# EAGLE design SOFTWEAR_microbit2 (EAGLE 9.4.2)
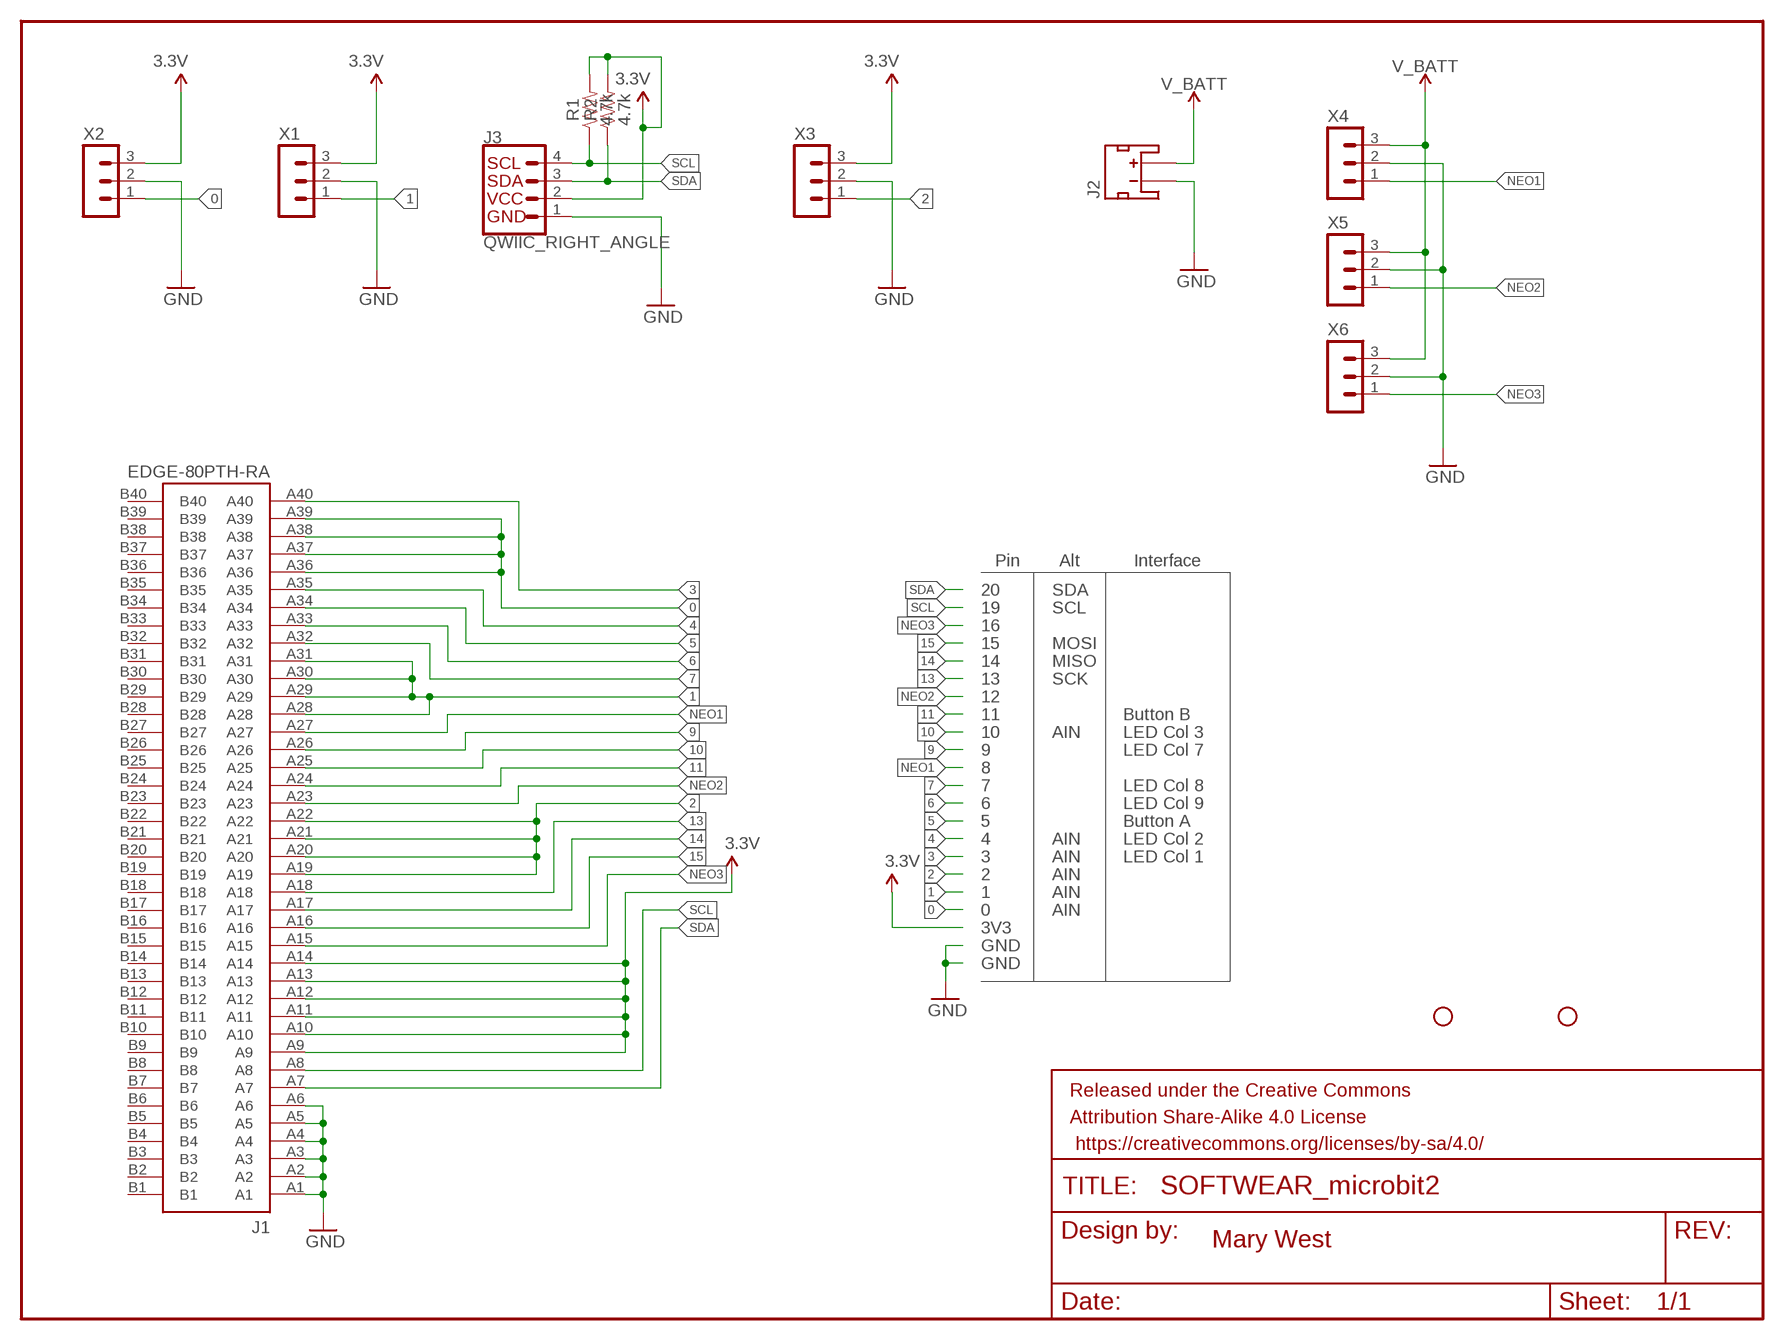
[diagram p0: schematic, sheet 1]

## Parts
FRAME2  FRAME-LETTERNO_PACKAGE  [DUMMY]
H1  STAND-OFF  [STAND-OFF]
H2  STAND-OFF  [STAND-OFF]
J1  EDGE-80PTH-RA  [VEC-127-080-R]
J2  JST_2MM_MALE  [JST-2-SMD]
J3  QWIIC_RIGHT_ANGLE  QWIIC_CONNECTORJS-1MM  [JST04_1MM_RA]
R1  4.7k  4.7KOHM-0603-1/10W-1%  [0603]
R2  4.7k  4.7KOHM-0603-1/10W-1%  [0603]
X1  SM03B-SRSS-TB  [SM03B-SRSS-TB]
X2  SM03B-SRSS-TB  [SM03B-SRSS-TB]
X3  SM03B-SRSS-TB  [SM03B-SRSS-TB]
X4  SM03B-SRSS-TB  [SM03B-SRSS-TB]
X5  SM03B-SRSS-TB  [SM03B-SRSS-TB]
X6  SM03B-SRSS-TB  [SM03B-SRSS-TB]

## Nets
0: J1.A36 J1.A37 J1.A38 J1.A39 X2.1
1: J1.A28 J1.A29 J1.A30 J1.A31 X1.1
2: J1.A19 J1.A20 J1.A21 J1.A22 X3.1
3: J1.A40
3.3V: J1.A9 J1.A10 J1.A11 J1.A12 J1.A13 J1.A14 J3.2 R1.2 R2.2 X1.3 X2.3 X3.3
4: J1.A35
5: J1.A34
6: J1.A33
7: J1.A32
9: J1.A26
10: J1.A25
11: J1.A24
13: J1.A18
14: J1.A17
15: J1.A16
GND: J1.A1 J1.A2 J1.A3 J1.A4 J1.A5 J1.A6 J2.1(-) J3.1 X1.2 X2.2 X3.2 X4.2 X5.2 X6.2
NEO1: J1.A27 X4.1
NEO2: J1.A23 X5.1
NEO3: J1.A15 X6.1
SCL: J1.A8 J3.4 R1.1
SDA: J1.A7 J3.3 R2.1
V_BATT: J2.2(+) X4.3 X5.3 X6.3
Unconnected: J1.B1 J1.B2 J1.B3 J1.B4 J1.B5 J1.B6 J1.B7 J1.B8 J1.B9 J1.B10 J1.B11 J1.B12 J1.B13 J1.B14 J1.B15 J1.B16 J1.B17 J1.B18 J1.B19 J1.B20 J1.B21 J1.B22 J1.B23 J1.B24 J1.B25 J1.B26 J1.B27 J1.B28 J1.B29 J1.B30 J1.B31 J1.B32 J1.B33 J1.B34 J1.B35 J1.B36 J1.B37 J1.B38 J1.B39 J1.B40 J2.NC1(PAD1) J2.NC2(PAD2)

## Notes on the sheet
- Pin | Alt | Interface
- 20 | SDA
- 19 | SCL
- 16
- 15 | MOSI
- 14 | MISO
- 13 | SCK
- 12
- 11 | Button B
- 10 | AIN | LED Col 3
- 9 | LED Col 7
- 8
- 7 | LED Col 8
- 6 | LED Col 9
- 5 | Button A
- 4 | AIN | LED Col 2
- 3 | AIN | LED Col 1
- 2 | AIN
- 1 | AIN
- 0 | AIN
- 3V3
- GND
- GND
- Mary West

## Library data of the parts
FRAME2 = SparkFun-Aesthetics:FRAME-LETTER: Schematic Frame - Letter Standard 8.5x11 US Letter frame; DESIGNER: Nobody; VERSION: v01
H1 H2 = SparkFun-Electromechanical:STAND-OFF: #4 Stand Off This is the mechanical footprint for a #4 phillips button head screw. Use the keepout ring to avoid running the screw head into surrounding components. SKU : PRT-00447
J1 = local_lib:EDGE-80: Card edge connector (80 pin) for accepting a PCB with finger edge pins. This connector will accept the BBC micro:bit board.; PROD_ID: CONN-13452
J2 = SparkFun-Connectors:JST_2MM_MALE: JST 2MM MALE RA CONNECTOR Two pin, compact surface mount connector. Commonly used as a battery input connection point. We really like the solid locking feeling and high current rating on these small connectors. We use these all the time as battery connectors. Mates to single-cell LiPo batteries. Here is the connector we sell at SparkFun: JST Right Angle Connector - White <https://www.sparkfun.com/products/8612> (PRT-08612) Datasheet <http://www.sparkfun.com/datasheets/Prototyping/Connectors/JST-Horizontal.pdf> It was used on these SparkFun products: SparkFun MOSFET Power Controller <https://www.sparkfun.com/products/11214> (PRT-11214) SparkFun Battery Babysitter - LiPo Battery Manager <https://www.sparkfun.com/products/13777> (PRT-13777) And many, many others that required a lipo battery connection.; PROD_ID: CONN-11443; SF_ID: PRT-08612
J3 = SparkFun-Connectors:QWIIC_CONNECTOR: SparkFun I2C Standard Qwiic Connector An SMD 1mm pitch JST connector makes it easy and quick (get it? Qwiic?) to connect I2C devices to each other. The Qwiic system <http://www.sparkfun.com/qwiic> enables fast and solderless connection between popular platforms and various sensors and actuators. We carry 200mm <https://www.sparkfun.com/products/14204>, 100mm <https://www.sparkfun.com/products/14205>, 50mm <https://www.sparkfun.com/products/14206>, and breadboard friendly <https://www.sparkfun.com/products/14207> Qwiic cables. We also offer 10 pcs strips <https://www.sparkfun.com/products/14323> the SMD connectors.; PROD_ID: CONN-13694
R1 R2 = SparkFun-Resistors:4.7KOHM: 4.7kΩ resistor A resistor is a passive two-terminal electrical component that implements electrical resistance as a circuit element. Resistors act to reduce current flow, and, at the same time, act to lower voltage levels within circuits. - Wikipedia; PROD_ID: RES-07857
X1-X6 = con-JST SH (1):SM03B-SRSS: JST SH series header 1.00mm pitch disconnectable crimp style connectors, horizontal (side entry type), 3 pins

## Board
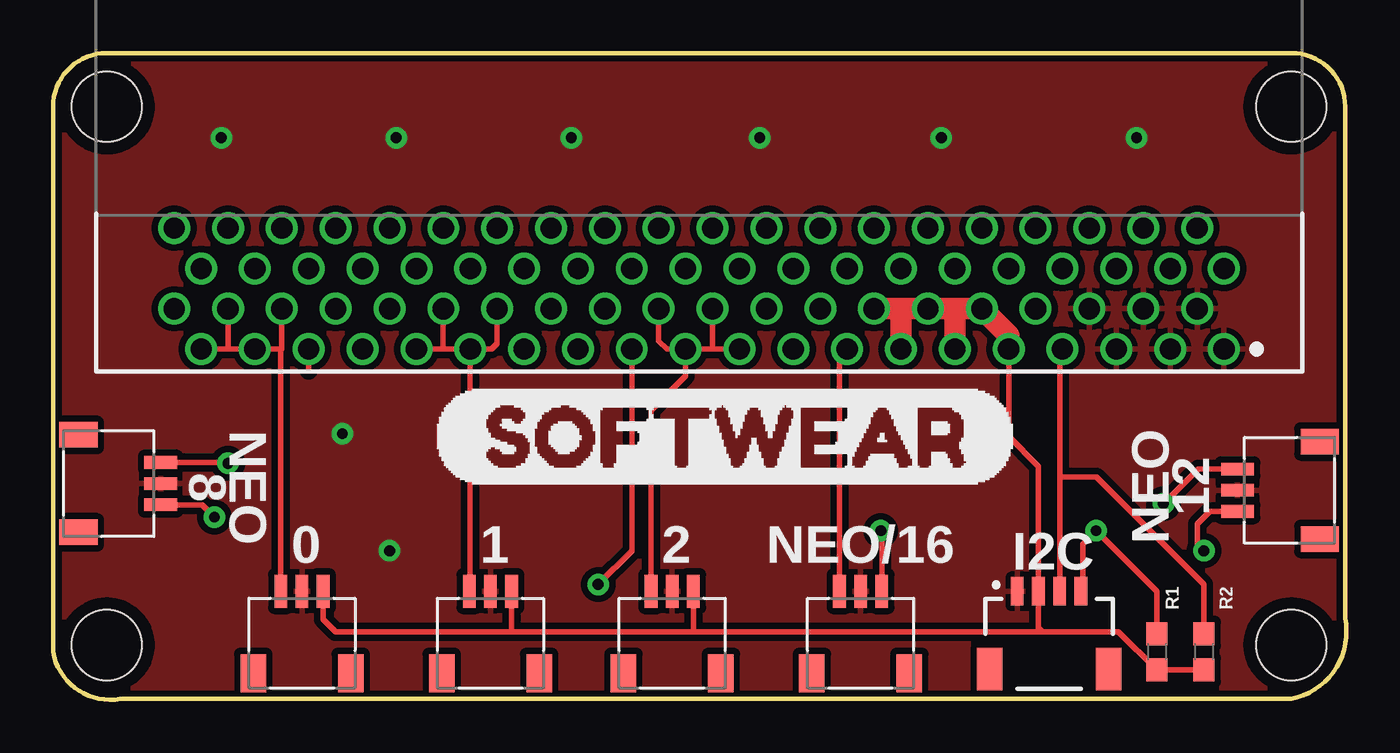
[diagram p1: board, top side]
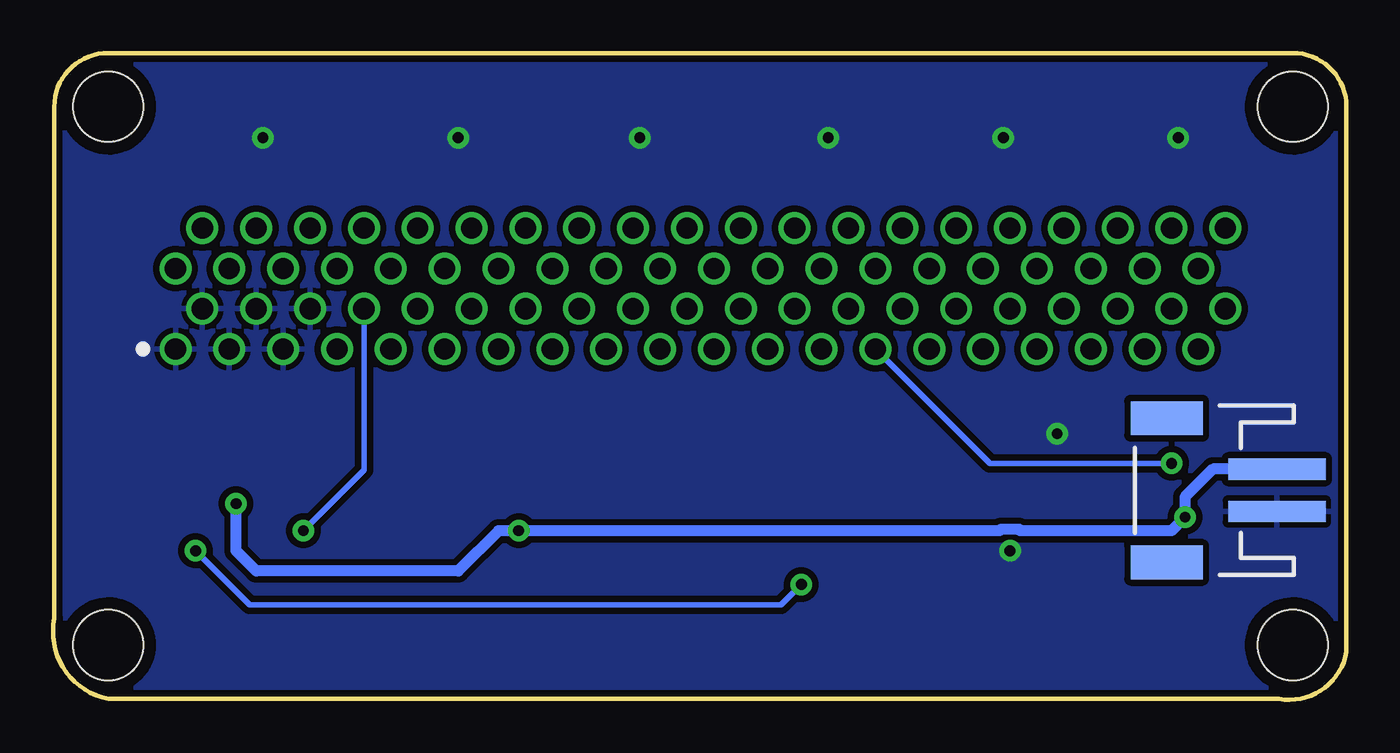
[diagram p2: board, bottom side, seen from below]

Size 61.02 x 30.52 mm. Coordinates in mm from the lower left corner, seen from the top.
Outline: 2.54,30.52 58.42,30.52 arc-90 60.96,27.98 60.96,3.85 arc-90 58.42,0.04 3.18,0.04 arc-90 0,2.26 0,27.98
Outline: 2.54,30.52 arc90 0,27.98
Outline: 2.54,30.52 arc90 0,27.98
Copper layers (1*16): Top 0.035mm / dielectric 1.5mm / Bottom 0.035mm
Design rules "SparkFun-2-layer-STANDARD": minimum track width 10mil, minimum drill 20mil, track to track 10mil, track to pad 8mil, pad to pad 8mil, via to via 10mil, smd to smd 8mil, copper to edge 8mil, drill to drill 8mil, minimum pad ring 10mil, minimum via ring 10mil, stop-mask expansion 4mil, vias tented up to drill 25mil, thermal gap 10mil

### Footprints (pad centres in the part's own frame; a part is rotated, then mirrored left to right if it is on the bottom)
STAND-OFF = hole 3.302: 0,0
VEC-127-080-R = drill 1: A1 -24.765,0; A2 -23.495,-1.9; A3 -22.225,0; A4 -20.955,-1.9; A5 -19.685,0; A6 -18.415,-1.9; A7 -17.145,0; A8 -15.875,-1.9; A9 -14.605,0; A10 -13.335,-1.9; A11 -12.065,0; A12 -10.795,-1.9; A13 -9.525,0; A14 -8.255,-1.9; A15 -6.985,0; A16 -5.715,-1.9; A17 -4.445,0; A18 -3.175,-1.9; A19 -1.905,0; A20 -0.635,-1.9; A21 0.635,0; A22 1.905,-1.9; A23 3.175,0; A24 4.445,-1.9; A25 5.715,0; A26 6.985,-1.9; A27 8.255,0; A28 9.525,-1.9; A29 10.795,0; A30 12.065,-1.9; A31 13.335,0; A32 14.605,-1.9; A33 15.875,0; A34 17.145,-1.9; A35 18.415,0; A36 19.685,-1.9; A37 20.955,0; A38 22.225,-1.9; A39 23.495,0; A40 24.765,-1.9; B1 -24.765,-3.8; B2 -23.495,-5.7; B3 -22.225,-3.8; B4 -20.955,-5.7; B5 -19.685,-3.8; B6 -18.415,-5.7; B7 -17.145,-3.8; B8 -15.875,-5.7; B9 -14.605,-3.8; B10 -13.335,-5.7; B11 -12.065,-3.8; B12 -10.795,-5.7; B13 -9.525,-3.8; B14 -8.255,-5.7; B15 -6.985,-3.8; B16 -5.715,-5.7; B17 -4.445,-3.8; B18 -3.175,-5.7; B19 -1.905,-3.8; B20 -0.635,-5.7; B21 0.635,-3.8; B22 1.905,-5.7; B23 3.175,-3.8; B24 4.445,-5.7; B25 5.715,-3.8; B26 6.985,-5.7; B27 8.255,-3.8; B28 9.525,-5.7; B29 10.795,-3.8; B30 12.065,-5.7; B31 13.335,-3.8; B32 14.605,-5.7; B33 15.875,-3.8; B34 17.145,-5.7; B35 18.415,-3.8; B36 19.685,-5.7; B37 20.955,-3.8; B38 22.225,-5.7; B39 23.495,-3.8; B40 24.765,-5.7
JST-2-SMD = smd 1 x 4.6: 1 -1,-3.7; 2 1,-3.7 | smd 1.6 x 3.4: NC1 -3.4,1.5; NC2 3.4,1.5
JST04_1MM_RA = smd 0.6 x 1.35: 1 -1.5,0; 2 -0.5,0; 3 0.5,0; 4 1.5,0 | smd 1.2 x 2: NC1 2.8,-3.675; NC2 -2.8,-3.675
0603 = smd 1.1 x 1: 1 -0.85,0; 2 0.85,0
SM03B-SRSS-TB = smd 0.6 x 1.55: 1 1,0; 2 0,0; 3 -1,0 | smd 1.2 x 1.8: M1 2.3,3.875; M2 -2.3,3.875

### Placement (x,y rotation side)
FRAME2  0,-1.23 0 top
H1  2.54,27.98 0 top
H2  58.42,27.98 0 top
H3  STAND-OFF  [STAND-OFF]  58.42,2.58 0 top
H4  STAND-OFF  [STAND-OFF]  2.54,2.58 0 top
J1  30.48,16.55 180 top
J2  6.98,9.88 90 bottom
J3  46.99,5.12 0 top
R1  52.07,2.26 270 top
R2  54.29,2.26 270 top
U$1  [SOFTWEAR0]  17.78,12.42 0 top
X1  20.64,5.12 180 top
X2  11.75,5.12 180 top
X3  29.21,5.12 180 top
X4  5.08,10.2 90 top
X5  55.88,9.88 270 top
X6  38.1,5.12 180 top

### Tracks (layer width: path | path; a pad name or v marks a point on that pad's centre or on a via)
0
  Top 0.254: J1.A39 8.25,16.55 | 8.25,16.55 J1.A37 10.79,16.55 | J1.A38 8.25,16.55 | J1.A36 10.79,16.55 | X2.1 10.75,16.5 10.79,16.55
1
  Top 0.254: J1.A31 18.42,16.55 | 18.42,16.55 J1.A29 | J1.A29 20.7,16.55 20.96,16.81 J1.A28 | J1.A30 18.42,16.55 | J1.A29 19.69,5.17 X1.1
2
  Top 0.254: J1.A19 31.11,16.55 | 31.11,16.55 J1.A21 | J1.A20 31.11,16.55 | J1.A21 28.96,16.55 28.57,16.93 J1.A22 | X3.1 28.21,13.65 29.85,15.28 J1.A21
3.3V
  Top 0.254: 12.7,5.07 X2.3 12.75,3.8 13.33,3.22 21.59,3.22 | J1.A9 45.09,12.42 46.49,11.02 J3.2 46.49,3.4 46.67,3.22 | R2.2 R1.2 50.27,3.22 46.67,3.22 | 46.67,3.22 30.16,3.22 | 30.16,3.22 21.59,3.22 | X3.3 30.21,3.26 30.16,3.22 | X1.3 21.64,3.26 21.59,3.22
  Top 1.016: J1.A9 45.09,17.18 J1.A10 42.42,18.45 | 42.42,18.45 J1.A12 39.88,18.45 | 39.88,18.45 J1.A14 | J1.A13 40,18.32 39.88,18.45 | J1.A11 42.54,18.32 42.42,18.45
4
  Top 0.254: J1.A35 12.06,15.54
GND  (via drill 0.51)
  other vias: 7.94,26.52 41.91,26.52 33.34,26.52 16.19,26.52 24.45,26.52 51.12,26.52 15.87,7.03 13.65,12.55
  pour Top (isolate 0.305): 0,30.52 0,0.04 60.96,0.04 60.96,30.52
  pour Bottom (isolate 0.305): 0,30.52 0,0.04 60.96,0.04 60.96,30.52
NEO1  (via drill 0.51)
  Top 0.254: X4.1 8.21,11.2 v8.25,11.15
  Bottom 0.254: v8.25,11.15 16.83,11.15 J1.A27
NEO2  (via drill 0.51)
  Top 0.254: X5.1 54.56,8.88 53.97,8.3 53.97,7.34 v54.29,7.03 | J1.A23 27.3,7.03 v25.72,5.44
  Bottom 0.254: v54.29,7.03 51.75,4.49 26.67,4.49 v25.72,5.44
NEO3
  Top 0.254: X6.1 37.1,16.19 J1.A15
SCL  (via drill 0.51)
  Top 0.254: 48.58,5.03 J3.4 48.58,5.21 48.58,7.34 v49.21,7.98 52.07,5.12 R1.1
  Bottom 0.254: v49.21,7.98 46.35,10.84 J1.A8
SDA
  Top 0.254: J1.A7 47.49,16.42 47.49,10.52 | R2.1 54.29,5.44 49.21,10.52 47.49,10.52 | J3.3 47.49,10.52
V_BATT  (via drill 0.51)
  Top 0.254: X5.3 54.02,10.88 v52.39,9.25 | v39.05,7.98 39.1,7.93 X6.3 | X4.3 7.03,9.2 v7.62,8.61
  Bottom 0.508: v52.39,9.25 52.39,7.03 51.43,6.07 41.91,6.07 40,7.98 v39.05,7.98 16.36,7.98 16.3,8.04 15.45,8.04 15.39,7.98 8.25,7.98 v7.62,8.61 7.62,9.57 6.3,10.88 J2.2

### Text on the board
tPlace: 8 | NEO | NEO | 12 | 0 | 1 | 2 | NEO/ | 16 | I2C